# Altium schematic sheet IndicatorLEDs.SchDoc
size A4
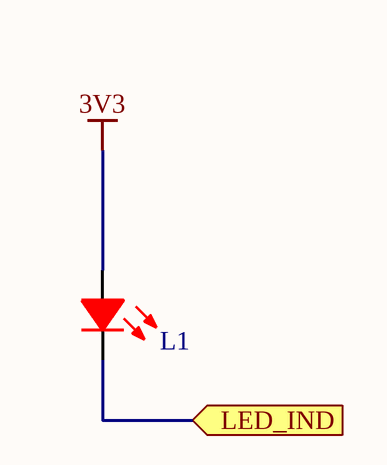
[diagram p0: IndicatorLEDs.SchDoc]

## Parts
L1  KPT-2012SURCK  [0808-LED]  (value not drawn)

## Ports
LED_IND (in)

## Nets
3V3: L1.A
LED_IND: L1.K ; port LED_IND

## Library data of the parts
L1 = KPT-2012SURCK: LED, Low Power, Red, SMD, 2 mA, 1.95 V, 630 nm